# Altium schematic sheet SML-230109PCB2__COVER.SchDoc
size A4; Organization: STAR Electrónica S.L.; Address1: Póligono industrial de Sárdoma; Address2: Avda. do Freixo, 32; Address3: 36214 - Vigo (Pontevedra); Address4: España; DocumentNumber: 1; SheetNumber: 1; SheetTotal: 2
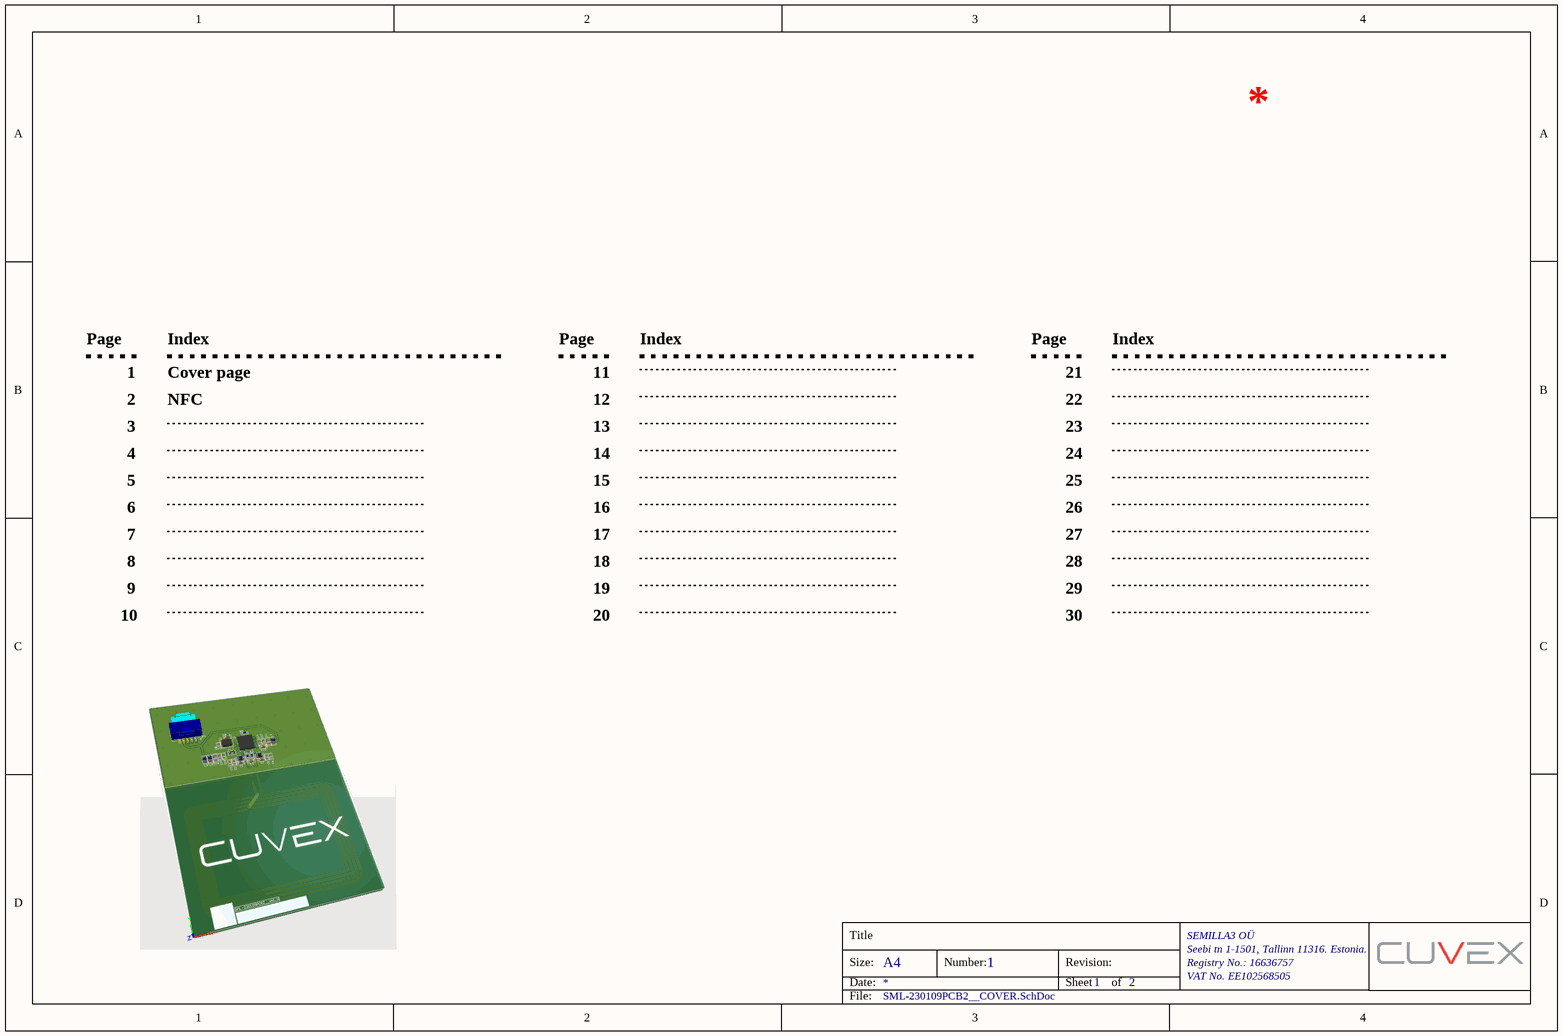
[diagram p0: SML-230109PCB2__COVER.SchDoc]

## Notes on the sheet
- Page
- 1
- Index
- Cover page
- 11
- 21
- 2
- 3
- NFC
- 12
- 13
- 22
- 23
- 4
- 5
- 6
- 14
- 15
- 16
- 24
- 25
- 26
- 7
- 8
- 17
- 18
- 27
- 28
- 10
- 9
- 19
- 20
- 29
- 30
- Title
- Size:
- Date:
- A4
- Number:
- Revision:
- Sheet
- of
- SEMILLA3 OÜ
- Seebi tn 1-1501, Tallinn 11316. Estonia.
- Registry No.: 16636757
- VAT No. EE102568505
- File: